# EasyEDA schematic 737NG MCDU_SidePanel_v.01.json
TITLE: 小侧板; REV: 1.0; Date: 2023-03-25; Sheet: 1/1; Drawn By: Fish SWA; Company: 114514下北泽有限公司
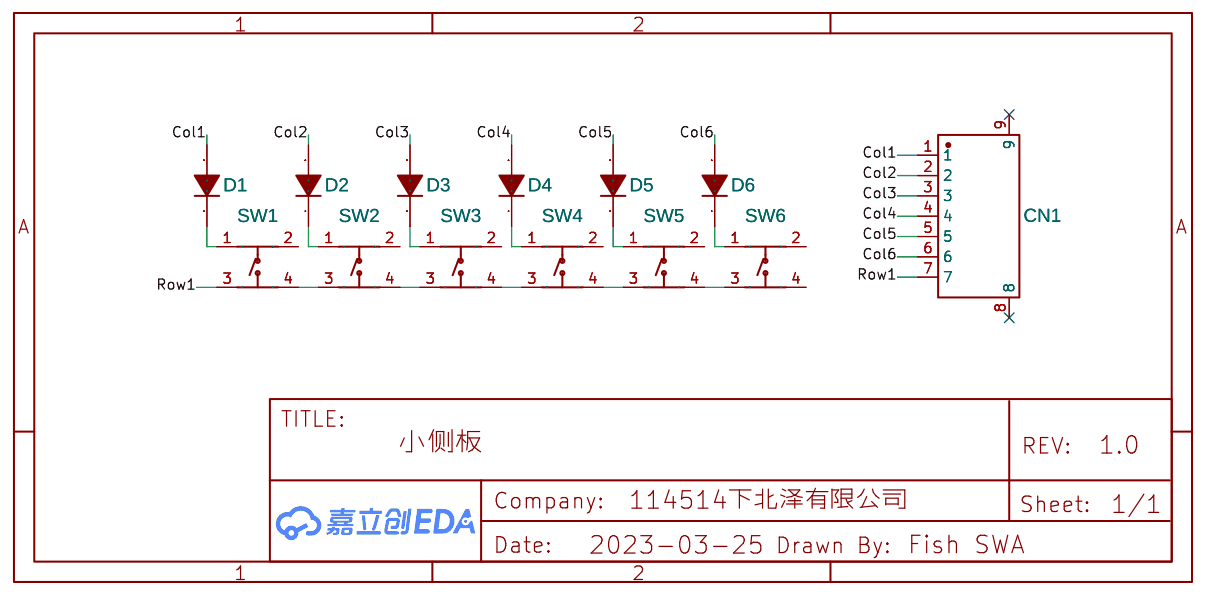
[diagram p0: schematic sheet]

## Parts
CN1  A1002WR-S-7P  [CONN-SMD_A1002WR-S-7P]
D1  1N4148WS T4  [SOD-323_L1.8-W1.3-LS2.5-RD]
D2  1N4148WS T4  [SOD-323_L1.8-W1.3-LS2.5-RD]
D3  1N4148WS T4  [SOD-323_L1.8-W1.3-LS2.5-RD]
D4  1N4148WS T4  [SOD-323_L1.8-W1.3-LS2.5-RD]
D5  1N4148WS T4  [SOD-323_L1.8-W1.3-LS2.5-RD]
D6  1N4148WS T4  [SOD-323_L1.8-W1.3-LS2.5-RD]
SW1  PTS525SM15SMTR2LFS  [KEY-SMD_4P-L5.2-W5.2-P3.80-LS6.2]
SW2  PTS525SM15SMTR2LFS  [KEY-SMD_4P-L5.2-W5.2-P3.80-LS6.2]
SW3  PTS525SM15SMTR2LFS  [KEY-SMD_4P-L5.2-W5.2-P3.80-LS6.2]
SW4  PTS525SM15SMTR2LFS  [KEY-SMD_4P-L5.2-W5.2-P3.80-LS6.2]
SW5  PTS525SM15SMTR2LFS  [KEY-SMD_4P-L5.2-W5.2-P3.80-LS6.2]
SW6  PTS525SM15SMTR2LFS  [KEY-SMD_4P-L5.2-W5.2-P3.80-LS6.2]

## Library data of the parts
CN1 = A1002WR-S-7P: Supplier: LCSC; Supplier Part: C239525; Manufacturer: CJT(长江连接器); Contributor: LCSC; JLCPCB Part Class: Extended Part
D1-D6 = 1N4148WS T4: Supplier: LCSC; Manufacturer: CJ(江苏长电/长晶); Manufacturer Part: 1N4148WS; Supplier Part: C2128; JLCPCB Part Class: Basic Part
SW1-SW6 = PTS525SM15SMTR2LFS: Supplier: LCSC; Supplier Part: C221856; Manufacturer: C&K; Contributor: LCSC; JLCPCB Part Class: Extended Part

## Nets
Col1: CN1.1 D1.2(A)
Col2: CN1.2 D2.2(A)
Col3: CN1.3 D3.2(A)
Col4: CN1.4 D4.2(A)
Col5: CN1.5 D5.2(A)
Col6: CN1.6 D6.2(A)
Row1: CN1.7 SW1.3
Net-(D1-1): D1.1(K) SW1.1
Net-(D2-1): D2.1(K) SW2.1
Net-(D3-1): D3.1(K) SW3.1
Net-(D4-1): D4.1(K) SW4.1
Net-(D5-1): D5.1(K) SW5.1
Net-(D6-1): D6.1(K) SW6.1
Net-(SW1-4): SW1.4 SW2.3
Net-(SW2-4): SW2.4 SW3.3
Net-(SW3-4): SW3.4 SW4.3
Net-(SW4-4): SW4.4 SW5.3
Net-(SW5-4): SW5.4 SW6.3

Not connected (* = marked no-connect by the designer): CN1 8* 9*; SW1 2; SW2 2; SW3 2; SW4 2; SW5 2; SW6 2 4
